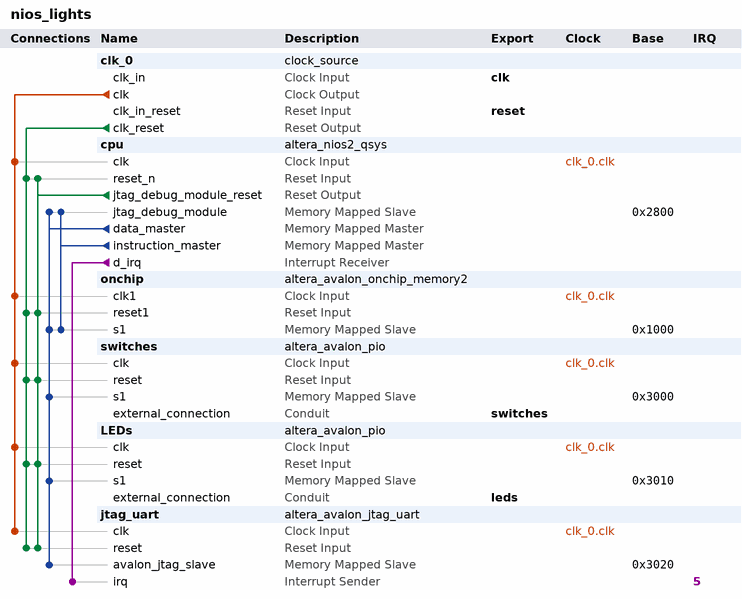
[diagram p0: system contents]
# Platform Designer (Qsys) system nios_lights, Cyclone V 5CSEMA5F31C6
# Parameters at their usual value, and those the tool derives, are not listed.
package require -exact qsys 14.1
create_system nios_lights
set_project_property DEVICE_FAMILY {Cyclone V}
set_project_property DEVICE 5CSEMA5F31C6

add_instance clk_0 clock_source 14.1
set_instance_parameter_value clk_0 clockFrequency 50000000

add_instance cpu altera_nios2_qsys 14.1
set_instance_parameter_value cpu breakSlave cpu.jtag_debug_module
set_instance_parameter_value cpu exceptionSlave onchip.s1
set_instance_parameter_value cpu icache_size 4096
set_instance_parameter_value cpu impl Tiny
set_instance_parameter_value cpu mmu_TLBMissExcSlave None
set_instance_parameter_value cpu resetSlave onchip.s1
set_instance_parameter_value cpu resetrequest_enabled true

add_instance onchip altera_avalon_onchip_memory2 14.1
set_instance_parameter_value onchip dataWidth 32
set_instance_parameter_value onchip dualPort false
set_instance_parameter_value onchip initMemContent true
set_instance_parameter_value onchip initializationFileName onchip_mem.hex
set_instance_parameter_value onchip memorySize 4096

add_instance switches altera_avalon_pio 14.1
set_instance_parameter_value switches direction Input
set_instance_parameter_value switches width 8

add_instance LEDs altera_avalon_pio 14.1
set_instance_parameter_value LEDs direction Output
set_instance_parameter_value LEDs width 8

add_instance jtag_uart altera_avalon_jtag_uart 14.1
set_instance_parameter_value jtag_uart simInteractiveOptions NO_INTERACTIVE_WINDOWS

# connections
add_connection clk_0.clk cpu.clk clock
add_connection clk_0.clk jtag_uart.clk clock
add_connection clk_0.clk LEDs.clk clock
add_connection clk_0.clk onchip.clk1 clock
add_connection clk_0.clk switches.clk clock
add_connection clk_0.clk_reset cpu.reset_n reset
add_connection clk_0.clk_reset jtag_uart.reset reset
add_connection clk_0.clk_reset LEDs.reset reset
add_connection clk_0.clk_reset onchip.reset1 reset
add_connection clk_0.clk_reset switches.reset reset
add_connection cpu.jtag_debug_module_reset cpu.reset_n reset
add_connection cpu.jtag_debug_module_reset jtag_uart.reset reset
add_connection cpu.jtag_debug_module_reset LEDs.reset reset
add_connection cpu.jtag_debug_module_reset onchip.reset1 reset
add_connection cpu.jtag_debug_module_reset switches.reset reset
add_connection cpu.data_master cpu.jtag_debug_module avalon
set_connection_parameter_value cpu.data_master/cpu.jtag_debug_module baseAddress 0x2800
add_connection cpu.data_master jtag_uart.avalon_jtag_slave avalon
set_connection_parameter_value cpu.data_master/jtag_uart.avalon_jtag_slave baseAddress 0x3020
add_connection cpu.data_master LEDs.s1 avalon
set_connection_parameter_value cpu.data_master/LEDs.s1 baseAddress 0x3010
add_connection cpu.data_master onchip.s1 avalon
set_connection_parameter_value cpu.data_master/onchip.s1 baseAddress 0x1000
add_connection cpu.data_master switches.s1 avalon
set_connection_parameter_value cpu.data_master/switches.s1 baseAddress 0x3000
add_connection cpu.instruction_master cpu.jtag_debug_module avalon
set_connection_parameter_value cpu.instruction_master/cpu.jtag_debug_module baseAddress 0x2800
add_connection cpu.instruction_master onchip.s1 avalon
set_connection_parameter_value cpu.instruction_master/onchip.s1 baseAddress 0x1000
add_connection cpu.d_irq jtag_uart.irq interrupt
set_connection_parameter_value cpu.d_irq/jtag_uart.irq irqNumber 5

# exported interfaces
add_interface clk clock sink
set_interface_property clk EXPORT_OF clk_0.clk_in
add_interface leds conduit end
set_interface_property leds EXPORT_OF LEDs.external_connection
add_interface reset reset sink
set_interface_property reset EXPORT_OF clk_0.clk_in_reset
add_interface switches conduit end
set_interface_property switches EXPORT_OF switches.external_connection

set_interconnect_requirement {$system} qsys_mm.clockCrossingAdapter HANDSHAKE
set_interconnect_requirement {$system} qsys_mm.insertDefaultSlave FALSE
set_interconnect_requirement {$system} qsys_mm.maxAdditionalLatency 1

save_system nios_lights.qsys
